# Altium schematic sheet Sheet2.SchDoc
size A4
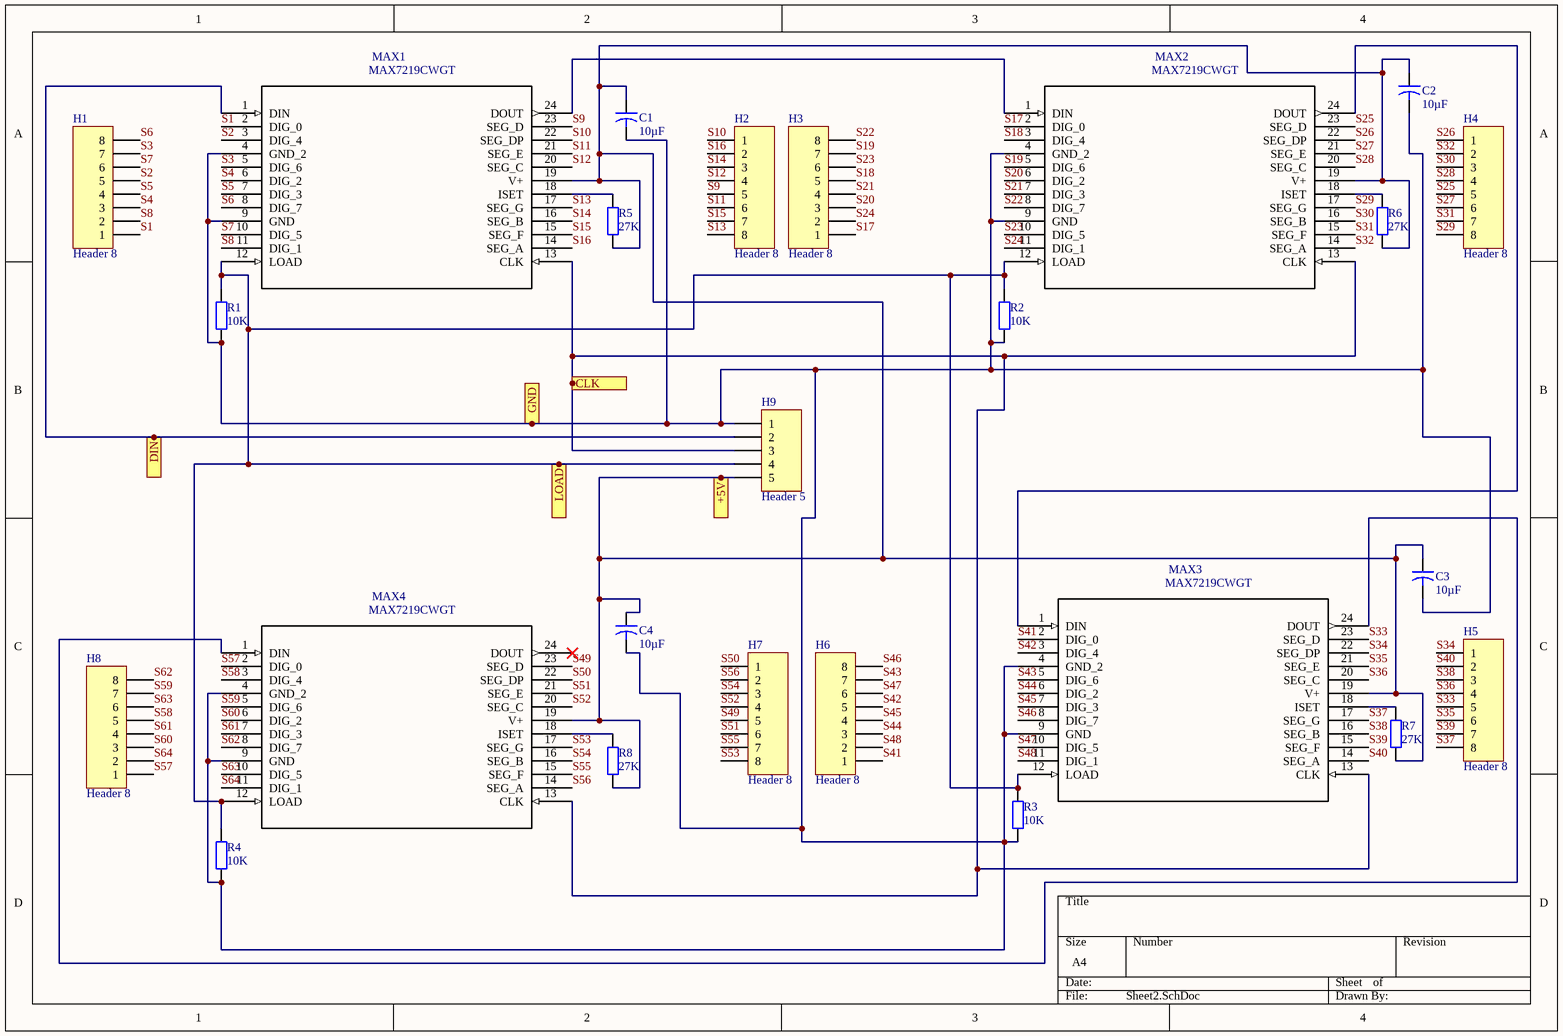
[diagram p0: Sheet2.SchDoc]

## Parts
C1  value 10µF  [CAPR5-4X5]  (hidden comment: Cap2)
C2  value 10µF  [CAPR5-4X5]  (hidden comment: Cap2)
C3  value 10µF  [CAPR5-4X5]  (hidden comment: Cap2)
C4  value 10µF  [CAPR5-4X5]  (hidden comment: Cap2)
H1  Header 8  [HDR1X8]
H2  Header 8  [HDR1X8]
H3  Header 8  [HDR1X8]
H4  Header 8  [HDR1X8]
H5  Header 8  [HDR1X8]
H6  Header 8  [HDR1X8]
H7  Header 8  [HDR1X8]
H8  Header 8  [HDR1X8]
H9  Header 5  [HDR1X5]
MAX1  MAX7219CWGT  [*21-0042B_24]
MAX2  MAX7219CWGT  [*21-0042B_24]
MAX3  MAX7219CWGT  [*21-0042B_24]
MAX4  MAX7219CWGT  [*21-0042B_24]
R1  value 10K  [AXIAL-0.4]  (hidden comment: Res2)
R2  value 10K  [AXIAL-0.4]  (hidden comment: Res2)
R3  value 10K  [AXIAL-0.4]  (hidden comment: Res2)
R4  value 10K  [AXIAL-0.4]  (hidden comment: Res2)
R5  value 27K  [AXIAL-0.4]  (hidden comment: Res2)
R6  value 27K  [AXIAL-0.4]  (hidden comment: Res2)
R7  value 27K  [AXIAL-0.4]  (hidden comment: Res2)
R8  value 27K  [AXIAL-0.4]  (hidden comment: Res2)

## Ports
+5V, CLK, DIN, GND, LOAD

## Nets
+5V: C1.1 C2.1 C3.1 C4.1 H9.5 MAX1.19(V+) MAX2.19(V+) MAX3.19(V+) MAX4.19(V+) R5.1 R6.1 R7.1 R8.1 ; port +5V
CLK: H9.3 MAX1.13(CLK) MAX2.13(CLK) MAX3.13(CLK) MAX4.13(CLK) ; port CLK
DIN: H9.2 MAX1.1(DIN) ; port DIN
GND: C1.2 C2.2 C3.2 C4.2 H9.1 MAX1.4(GND_2) MAX1.9(GND) MAX2.4(GND_2) MAX2.9(GND) MAX3.4(GND_2) MAX3.9(GND) MAX4.4(GND_2) MAX4.9(GND) R1.1 R2.1 R3.1 R4.1 ; port GND
LOAD: H9.4 MAX1.12(LOAD) MAX2.12(LOAD) MAX3.12(LOAD) MAX4.12(LOAD) R1.2 R2.2 R3.2 R4.2 ; port LOAD
S1: H1.1 MAX1.2(DIG_0)
S2: H1.5 MAX1.3(DIG_4)
S3: H1.7 MAX1.5(DIG_6)
S4: H1.3 MAX1.6(DIG_2)
S5: H1.4 MAX1.7(DIG_3)
S6: H1.8 MAX1.8(DIG_7)
S7: H1.6 MAX1.10(DIG_5)
S8: H1.2 MAX1.11(DIG_1)
S9: H2.5 MAX1.23(SEG_D)
S10: H2.1 MAX1.22(SEG_DP)
S11: H2.6 MAX1.21(SEG_E)
S12: H2.4 MAX1.20(SEG_C)
S13: H2.8 MAX1.17(SEG_G)
S14: H2.3 MAX1.16(SEG_B)
S15: H2.7 MAX1.15(SEG_F)
S16: H2.2 MAX1.14(SEG_A)
S17: H3.1 MAX2.2(DIG_0)
S18: H3.5 MAX2.3(DIG_4)
S19: H3.7 MAX2.5(DIG_6)
S20: H3.3 MAX2.6(DIG_2)
S21: H3.4 MAX2.7(DIG_3)
S22: H3.8 MAX2.8(DIG_7)
S23: H3.6 MAX2.10(DIG_5)
S24: H3.2 MAX2.11(DIG_1)
S25: H4.5 MAX2.23(SEG_D)
S26: H4.1 MAX2.22(SEG_DP)
S27: H4.6 MAX2.21(SEG_E)
S28: H4.4 MAX2.20(SEG_C)
S29: H4.8 MAX2.17(SEG_G)
S30: H4.3 MAX2.16(SEG_B)
S31: H4.7 MAX2.15(SEG_F)
S32: H4.2 MAX2.14(SEG_A)
S33: H5.5 MAX3.23(SEG_D)
S34: H5.1 MAX3.22(SEG_DP)
S35: H5.6 MAX3.21(SEG_E)
S36: H5.4 MAX3.20(SEG_C)
S37: H5.8 MAX3.17(SEG_G)
S38: H5.3 MAX3.16(SEG_B)
S39: H5.7 MAX3.15(SEG_F)
S40: H5.2 MAX3.14(SEG_A)
S41: H6.1 MAX3.2(DIG_0)
S42: H6.5 MAX3.3(DIG_4)
S43: H6.7 MAX3.5(DIG_6)
S44: H6.3 MAX3.6(DIG_2)
S45: H6.4 MAX3.7(DIG_3)
S46: H6.8 MAX3.8(DIG_7)
S47: H6.6 MAX3.10(DIG_5)
S48: H6.2 MAX3.11(DIG_1)
S49: H7.5 MAX4.23(SEG_D)
S50: H7.1 MAX4.22(SEG_DP)
S51: H7.6 MAX4.21(SEG_E)
S52: H7.4 MAX4.20(SEG_C)
S53: H7.8 MAX4.17(SEG_G)
S54: H7.3 MAX4.16(SEG_B)
S55: H7.7 MAX4.15(SEG_F)
S56: H7.2 MAX4.14(SEG_A)
S57: H8.1 MAX4.2(DIG_0)
S58: H8.5 MAX4.3(DIG_4)
S59: H8.7 MAX4.5(DIG_6)
S60: H8.3 MAX4.6(DIG_2)
S61: H8.4 MAX4.7(DIG_3)
S62: H8.8 MAX4.8(DIG_7)
S63: H8.6 MAX4.10(DIG_5)
S64: H8.2 MAX4.11(DIG_1)
NetMAX1_18: MAX1.18(ISET) R5.2
NetMAX1_24: MAX1.24(DOUT) MAX2.1(DIN)
NetMAX2_18: MAX2.18(ISET) R6.2
NetMAX2_24: MAX2.24(DOUT) MAX3.1(DIN)
NetMAX3_18: MAX3.18(ISET) R7.2
NetMAX3_24: MAX3.24(DOUT) MAX4.1(DIN)
NetMAX4_18: MAX4.18(ISET) R8.2

Not connected (* = marked no-connect by the designer): MAX4 24(DOUT)*

## Library data of the parts
C1-C4 = Cap2: Capacitor; Published: 23-Sep-2002; PackageReference: CAPR5-4X5; Publisher: Altium Limited; PackageDescription: Capacitor; 2 Leads
H1-H8 = Header 8: Header, 8-Pin; LatestRevisionDate: 17-Jul-2002; LatestRevisionNote: Re-released for DXP Platform.; Publisher: Altium Limited
H9 = Header 5: Header, 5-Pin; LatestRevisionDate: 17-Jul-2002; LatestRevisionNote: Re-released for DXP Platform.; Publisher: Altium Limited
R1-R4 = Res2_1: Resistor; Published: 8-Jun-2000; LatestRevisionDate: 17-Jul-2002; LatestRevisionNote: Re-released for DXP Platform.; PackageReference: AXIAL-0.4; Publisher: Altium Limited; PackageDescription: Axial Device, Thru-Hole; 2 Leads; 0.4 in Pin Spacing
R5-R8 = Res2: Resistor; Published: 8-Jun-2000; LatestRevisionDate: 17-Jul-2002; LatestRevisionNote: Re-released for DXP Platform.; PackageReference: AXIAL-0.4; Publisher: Altium Limited; PackageDescription: Axial Device, Thru-Hole; 2 Leads; 0.4 in Pin Spacing
MAX1-MAX4 = MAX7219CWGT: SnapEDA_Link: https://www.snapeda.com/parts/MAX7219CWG/Maxim%20Integrated/view-part/3218774/?ref=snap; Value: *